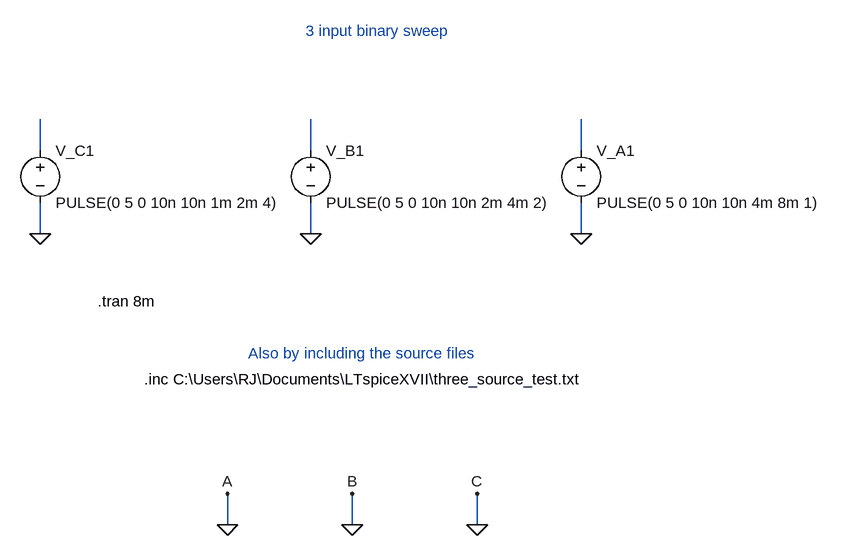
[diagram p0: schematic repeated_pulses_example.asc]
repeated_pulses_example.asc, the LTspice schematic file:
Version 4
SHEET 1 1288 708
WIRE 64 112 64 64
WIRE 480 112 480 64
WIRE 896 112 896 64
WIRE 64 240 64 192
WIRE 480 240 480 192
WIRE 896 240 896 192
WIRE 352 688 352 640
WIRE 544 688 544 640
WIRE 736 688 736 640
FLAG 64 240 0
FLAG 480 240 0
FLAG 896 240 0
FLAG 352 688 0
FLAG 544 688 0
FLAG 736 688 0
FLAG 352 640 A
FLAG 544 640 B
FLAG 736 640 C
SYMBOL voltage 64 96 R0
WINDOW 123 0 0 Left 0
WINDOW 39 0 0 Left 0
SYMATTR InstName V_C1
SYMATTR Value PULSE(0 5 0 10n 10n 1m 2m 4)
SYMBOL voltage 480 96 R0
WINDOW 123 0 0 Left 0
WINDOW 39 0 0 Left 0
SYMATTR InstName V_B1
SYMATTR Value PULSE(0 5 0 10n 10n 2m 4m 2)
SYMBOL voltage 896 96 R0
WINDOW 123 0 0 Left 0
WINDOW 39 0 0 Left 0
SYMATTR InstName V_A1
SYMATTR Value PULSE(0 5 0 10n 10n 4m 8m 1)
TEXT 152 344 Left 2 !.tran 8m
TEXT 472 -72 Left 2 ;3 input binary sweep
TEXT 384 424 Left 2 ;Also by including the source files
TEXT 224 464 Left 2 !.inc C:\\Users\\RJ\\Documents\\LTspiceXVII\\three_source_test.txt

The netlist it stands for:
* repeated_pulses_example.asc
V_C1 N001 0 PULSE(0 5 0 10n 10n 1m 2m 4)
V_B1 N002 0 PULSE(0 5 0 10n 10n 2m 4m 2)
V_A1 N003 0 PULSE(0 5 0 10n 10n 4m 8m 1)
.tran 8m
* 3 input binary sweep
* Also by including the source files
.inc C:\Users\RJ\Documents\LTspiceXVII\three_source_test.txt
.backanno
.end